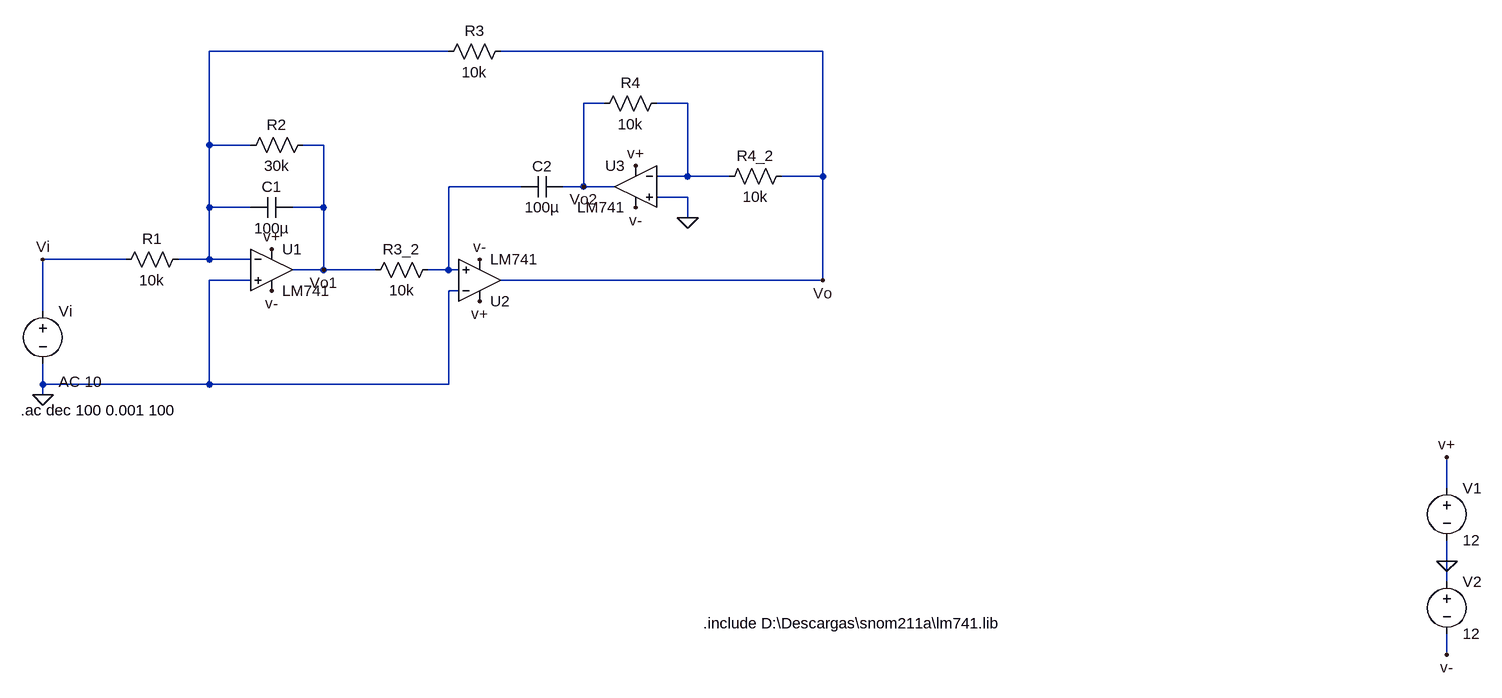
[diagram p0: schematic TS2.asc]
TS2.asc, the LTspice schematic file:
Version 4
SHEET 1 2200 764
WIRE 608 -240 240 -240
WIRE 1184 -240 688 -240
WIRE 848 -160 816 -160
WIRE 976 -160 928 -160
WIRE 240 -96 240 -240
WIRE 304 -96 240 -96
WIRE 416 -96 384 -96
WIRE 976 -48 976 -160
WIRE 976 -48 928 -48
WIRE 1040 -48 976 -48
WIRE 1184 -48 1184 -240
WIRE 1184 -48 1120 -48
WIRE 720 -32 608 -32
WIRE 816 -32 816 -160
WIRE 816 -32 784 -32
WIRE 864 -32 816 -32
WIRE 976 -16 928 -16
WIRE 240 0 240 -96
WIRE 304 0 240 0
WIRE 416 0 416 -96
WIRE 416 0 368 0
WIRE 976 16 976 -16
WIRE 112 80 -16 80
WIRE 240 80 240 0
WIRE 240 80 192 80
WIRE 304 80 240 80
WIRE 416 96 416 0
WIRE 416 96 368 96
WIRE 496 96 416 96
WIRE 608 96 608 -32
WIRE 608 96 576 96
WIRE 624 96 608 96
WIRE 304 112 240 112
WIRE 1184 112 1184 -48
WIRE 1184 112 688 112
WIRE 624 128 608 128
WIRE -16 160 -16 80
WIRE -16 272 -16 240
WIRE 240 272 240 112
WIRE 240 272 -16 272
WIRE 608 272 608 128
WIRE 608 272 240 272
WIRE -16 288 -16 272
WIRE 2144 432 2144 384
WIRE 2144 544 2144 512
WIRE 2144 576 2144 544
WIRE 2144 688 2144 656
FLAG 976 16 0
FLAG -16 288 0
FLAG -16 80 Vi
FLAG 416 96 Vo1
FLAG 816 -32 Vo2
FLAG 1184 112 Vo
FLAG 2144 544 0
FLAG 2144 384 v+
FLAG 2144 688 v-
FLAG 336 64 v+
FLAG 656 144 v+
FLAG 896 -64 v+
FLAG 336 128 v-
FLAG 656 80 v-
FLAG 896 0 v-
SYMBOL voltage -16 144 R0
WINDOW 123 24 124 Left 2
WINDOW 39 0 0 Left 0
SYMATTR InstName Vi
SYMATTR Value ""
SYMATTR Value2 AC 10
SYMBOL res 208 64 R90
WINDOW 0 0 56 VBottom 2
WINDOW 3 32 56 VTop 2
SYMATTR InstName R1
SYMATTR Value 10k
SYMBOL res 400 -112 R90
WINDOW 0 0 56 VBottom 2
WINDOW 3 32 56 VTop 2
SYMATTR InstName R2
SYMATTR Value 30k
SYMBOL res 704 -256 R90
WINDOW 0 0 56 VBottom 2
WINDOW 3 32 56 VTop 2
SYMATTR InstName R3
SYMATTR Value 10k
SYMBOL res 944 -176 R90
WINDOW 0 0 56 VBottom 2
WINDOW 3 32 56 VTop 2
SYMATTR InstName R4
SYMATTR Value 10k
SYMBOL res 592 80 R90
WINDOW 0 0 56 VBottom 2
WINDOW 3 32 56 VTop 2
SYMATTR InstName R3_2
SYMATTR Value 10k
SYMBOL res 1136 -64 R90
WINDOW 0 0 56 VBottom 2
WINDOW 3 32 56 VTop 2
SYMATTR InstName R4_2
SYMATTR Value 10k
SYMBOL cap 368 -16 R90
WINDOW 0 0 32 VBottom 2
WINDOW 3 32 32 VTop 2
SYMATTR InstName C1
SYMATTR Value 100µ
SYMBOL cap 784 -48 R90
WINDOW 0 0 32 VBottom 2
WINDOW 3 32 32 VTop 2
SYMATTR InstName C2
SYMATTR Value 100µ
SYMBOL OpAmps\\opamp2 336 32 R0
SYMATTR InstName U1
SYMATTR Value LM741
SYMBOL OpAmps\\opamp2 656 176 M180
SYMATTR InstName U2
SYMATTR Value LM741
SYMBOL OpAmps\\opamp2 896 -96 M0
SYMATTR InstName U3
SYMATTR Value LM741
SYMBOL voltage 2144 416 R0
WINDOW 123 0 0 Left 0
WINDOW 39 0 0 Left 0
SYMATTR InstName V1
SYMATTR Value 12
SYMBOL voltage 2144 560 R0
WINDOW 123 0 0 Left 0
WINDOW 39 0 0 Left 0
SYMATTR InstName V2
SYMATTR Value 12
TEXT -50 312 Left 2 !.ac dec 100 0.001 100
TEXT 1000 640 Left 2 !.include D:\\Descargas\\snom211a\\lm741.lib

The netlist it stands for:
* TS2.asc
Vi Vi 0 AC 10
R1 N001 Vi 10k
R2 Vo1 N001 30k
R3 Vo N001 10k
R4 N002 Vo2 10k
R3_2 N003 Vo1 10k
R4_2 Vo N002 10k
C1 Vo1 N001 100µ
C2 Vo2 N003 100µ
XU1 0 N001 v+ v- Vo1 LM741  ; pins In+ In- V+ V- OUT
XU2 N003 0 v+ v- Vo LM741  ; pins In+ In- V+ V- OUT
XU3 0 N002 v+ v- Vo2 LM741  ; pins In+ In- V+ V- OUT
V1 v+ 0 12
V2 0 v- 12
.ac dec 100 0.001 100
.include D:\Descargas\snom211a\lm741.lib
.backanno
.end